# Altium schematic sheet buttonpad.SchDoc
size A3
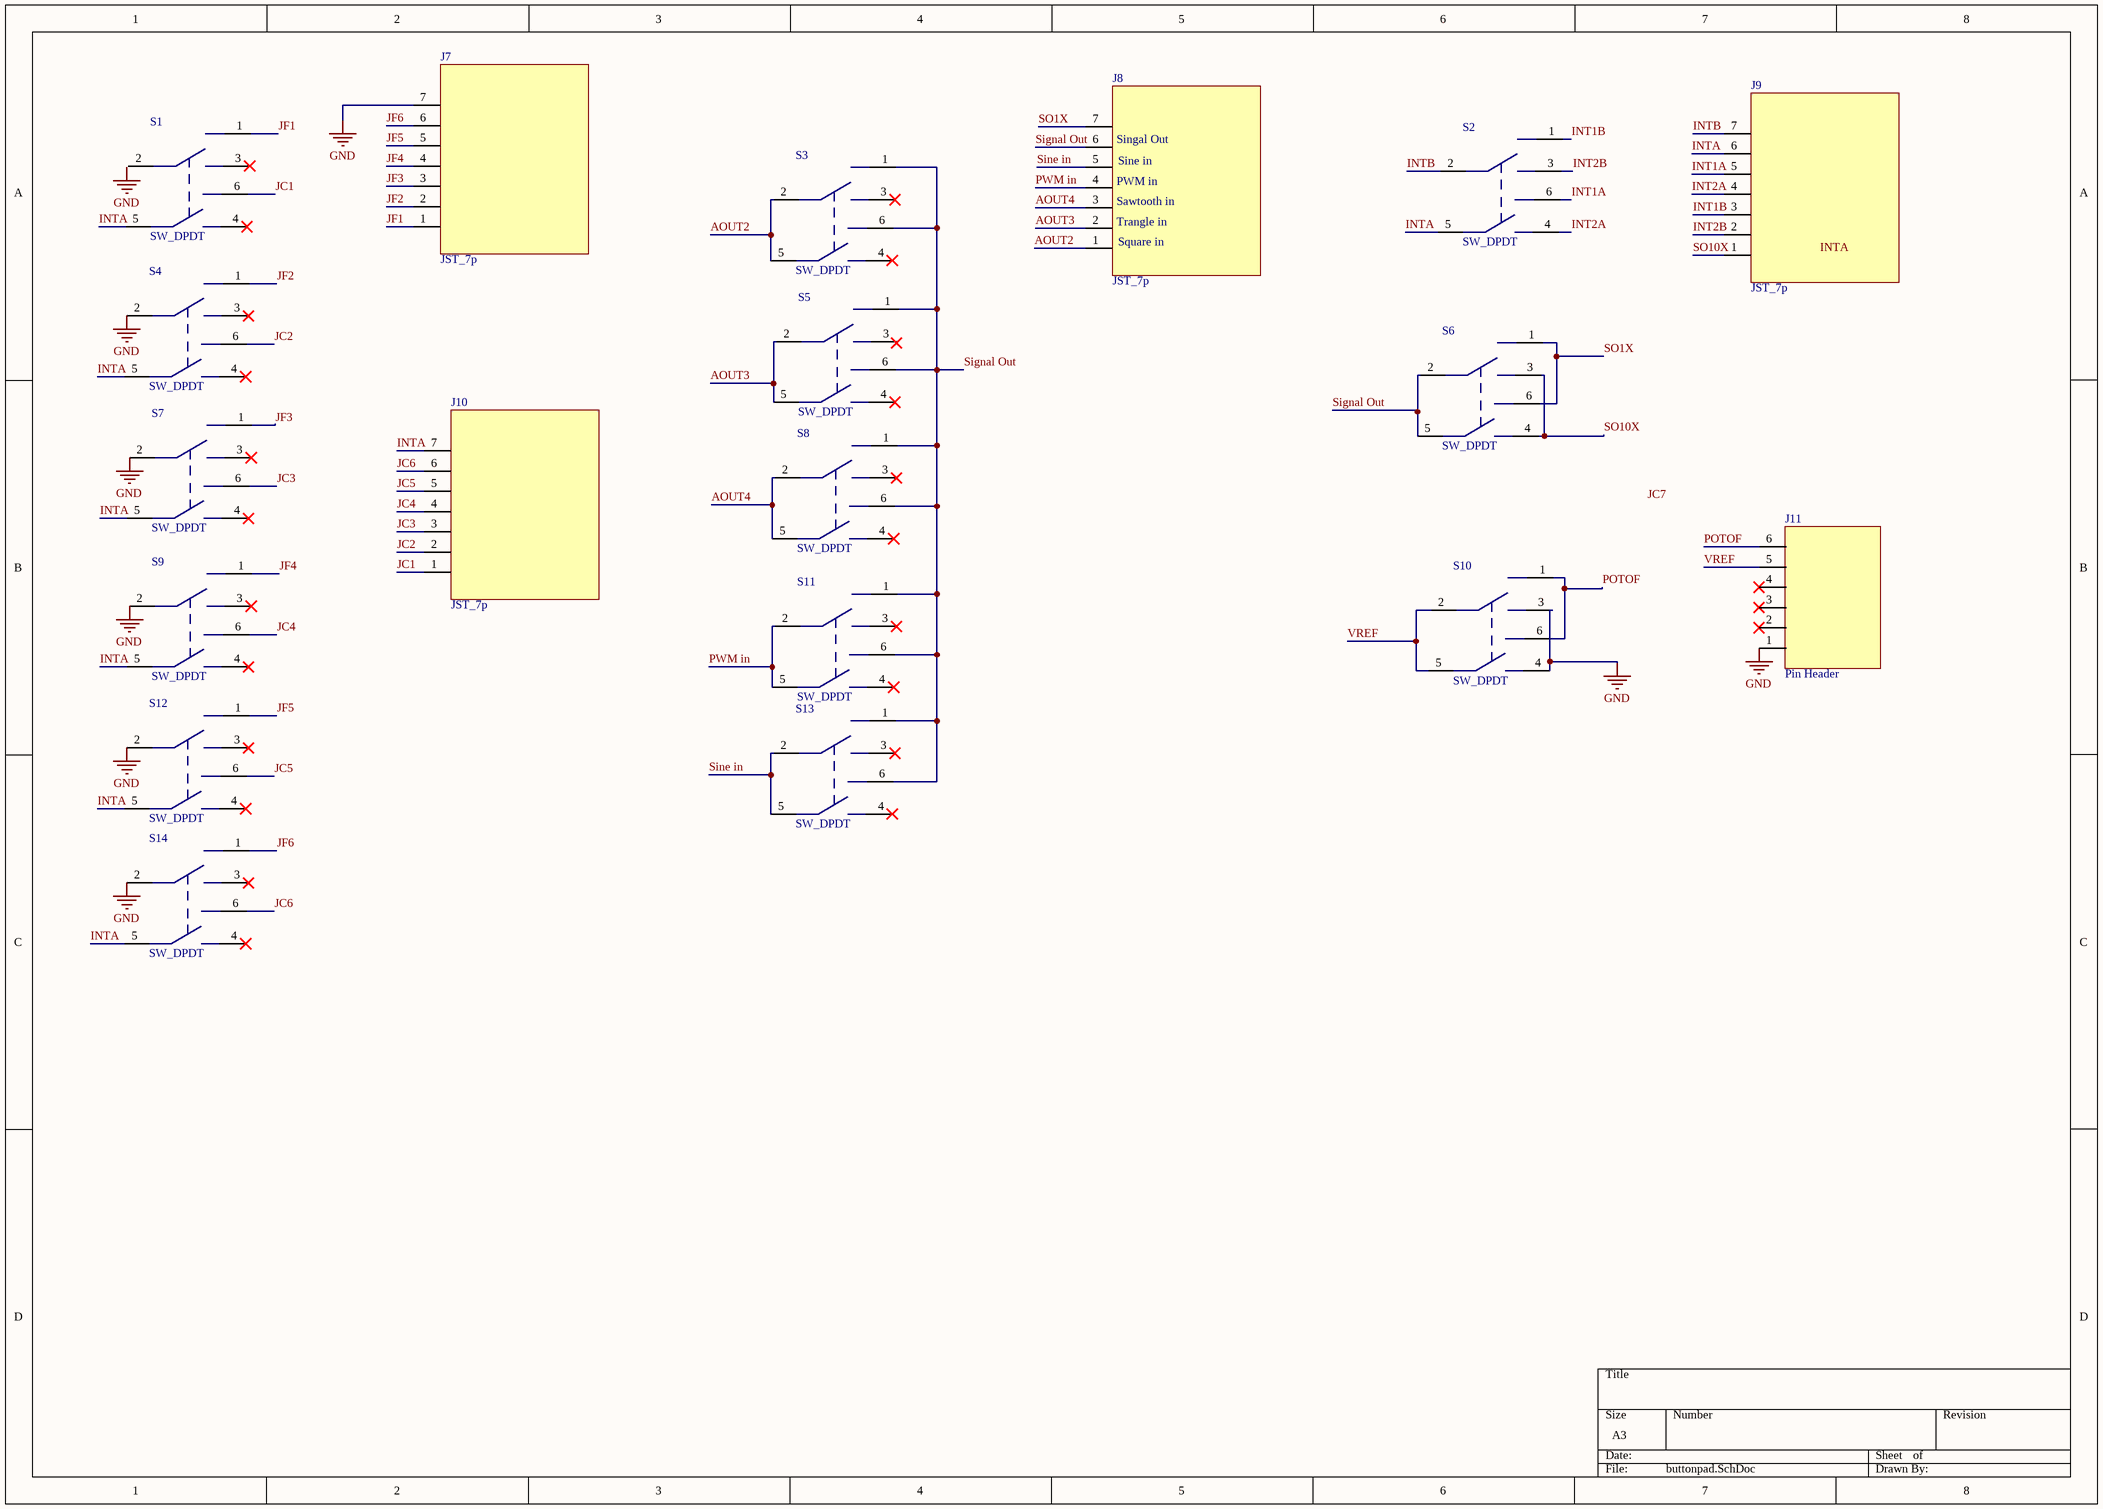
[diagram p0: buttonpad.SchDoc]

## Parts
J7  JST_7p  [JST_7p]
J8  JST_7p  [JST_7p]
J9  JST_7p  [JST_7p]
J10  JST_7p  [JST_7p]
J11  Pin Header  [JST_6p]
S1  SW_DPDT  [SW DPDT]
S2  SW_DPDT  [SW DPDT]
S3  SW_DPDT  [SW DPDT]
S4  SW_DPDT  [SW DPDT]
S5  SW_DPDT  [SW DPDT]
S6  SW_DPDT  [SW DPDT]
S7  SW_DPDT  [SW DPDT]
S8  SW_DPDT  [SW DPDT]
S9  SW_DPDT  [SW DPDT]
S10  SW_DPDT  [SW DPDT]
S11  SW_DPDT  [SW DPDT]
S12  SW_DPDT  [SW DPDT]
S13  SW_DPDT  [SW DPDT]
S14  SW_DPDT  [SW DPDT]

## Nets
GND: J7.7 J11.1 S4.2 S7.2 S9.2 S10.3 S10.4 S12.2 S14.2
AOUT2: J8.1 S3.2 S3.5
AOUT3: J8.2 S5.2 S5.5
AOUT4: J8.3 S8.2 S8.5
INT1A: J9.5 S2.6
INT1B: J9.3 S2.1
INT2A: J9.4 S2.4
INT2B: J9.2 S2.3
INTA: J9.6 J10.7 S1.5 S2.5 S4.5 S7.5 S9.5 S12.5 S14.5
INTB: J9.7 S2.2
JC1: J10.1 S1.6
JC2: J10.2 S4.6
JC3: J10.3 S7.6
JC4: J10.4 S9.6
JC5: J10.5 S12.6
JC6: J10.6 S14.6
JF1: J7.1 S1.1
JF2: J7.2 S4.1
JF3: J7.3 S7.1
JF4: J7.4 S9.1
JF5: J7.5 S12.1
JF6: J7.6 S14.1
POTOF: J11.6 S10.1 S10.6
PWM in: J8.4 S11.2 S11.5
Signal Out: J8.6 S3.1 S3.6 S5.1 S5.6 S6.2 S6.5 S8.1 S8.6 S11.1 S11.6 S13.1 S13.6
Sine in: J8.5 S13.2 S13.5
SO1X: J8.7 S6.1 S6.6
SO10X: J9.1 S6.3 S6.4
VREF: J11.5 S10.2 S10.5

Not connected (* = marked no-connect by the designer): J11 2* 3* 4*; S1 2 3* 4*; S3 3* 4*; S4 3* 4*; S5 3 4*; S7 3* 4*; S8 3* 4*; S9 3* 4*; S11 3* 4*; S12 3* 4*; S13 3* 4*; S14 3* 4*

## Notes on the sheet
- (near J8) Singal Out
- (near J8) Sine in
- (near J8) Trangle in
- (near J8) Sawtooth in
- (near J8) PWM in
- (near J8) Square in
- Labels drawn without touching a wire or pin: GND, INTA, JC7

## Library data of the parts
J11 = JST_6p